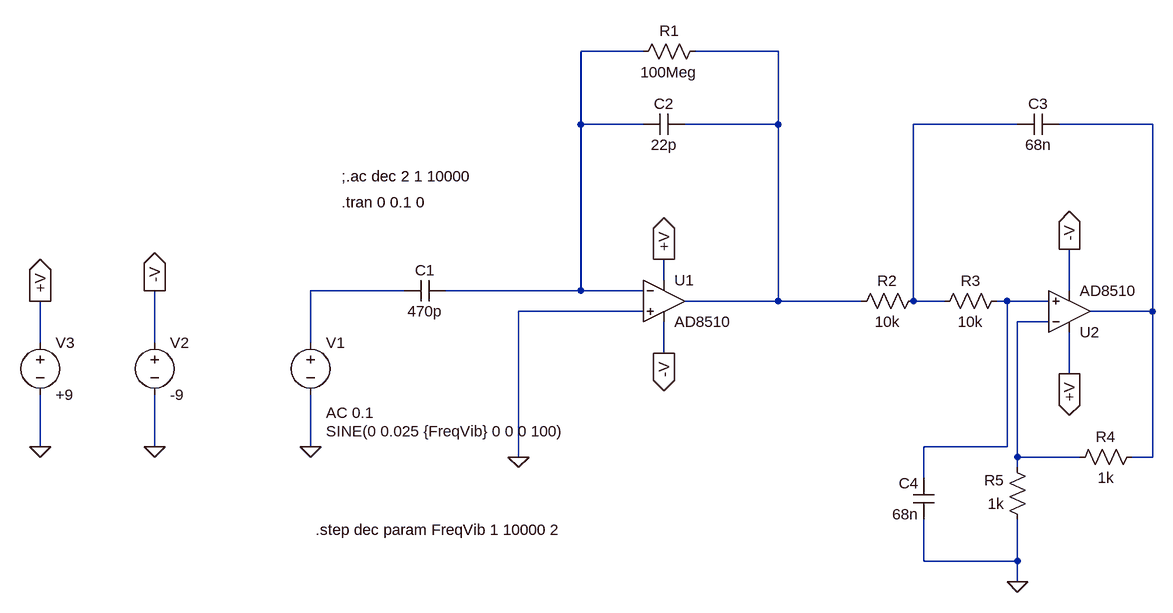
[diagram p0: schematic piezo-film-ac.asc]
piezo-film-ac.asc, the LTspice schematic file:
Version 4
SHEET 1 1420 680
WIRE 224 -240 128 -240
WIRE 432 -240 304 -240
WIRE 128 -128 128 -240
WIRE 224 -128 128 -128
WIRE 432 -128 432 -240
WIRE 432 -128 288 -128
WIRE 800 -128 640 -128
WIRE 1008 -128 864 -128
WIRE 256 112 256 80
WIRE -144 128 -288 128
WIRE 128 128 128 -128
WIRE 128 128 -80 128
WIRE 224 128 128 128
WIRE 880 128 880 64
WIRE 432 144 432 -128
WIRE 432 144 288 144
WIRE 560 144 432 144
WIRE 640 144 640 -128
WIRE 688 144 640 144
WIRE 784 144 768 144
WIRE 848 144 784 144
WIRE 224 160 32 160
WIRE 1008 160 1008 -128
WIRE 1008 160 912 160
WIRE 848 176 800 176
WIRE -704 208 -704 144
WIRE -528 208 -528 128
WIRE -288 208 -288 128
WIRE 256 224 256 176
WIRE 880 256 880 192
WIRE -704 368 -704 288
WIRE -528 368 -528 288
WIRE -288 368 -288 288
WIRE 784 368 784 144
WIRE 784 368 656 368
WIRE 32 384 32 160
WIRE 800 384 800 176
WIRE 896 384 800 384
WIRE 1008 384 1008 160
WIRE 1008 384 976 384
WIRE 800 400 800 384
WIRE 656 416 656 368
WIRE 656 544 656 480
WIRE 800 544 800 480
WIRE 800 544 656 544
WIRE 800 576 800 544
FLAG 32 384 0
FLAG -528 368 0
FLAG -704 368 0
FLAG -704 144 +V
IOPIN -704 144 Out
FLAG -528 128 -V
IOPIN -528 128 Out
FLAG -288 368 0
FLAG 256 224 -V
IOPIN 256 224 Out
FLAG 256 80 +V
IOPIN 256 80 Out
FLAG 880 256 +V
IOPIN 880 256 Out
FLAG 880 64 -V
IOPIN 880 64 Out
FLAG 800 576 0
SYMBOL Opamps\\AD8510 256 80 R0
SYMATTR InstName U1
SYMBOL voltage -288 192 R0
WINDOW 3 24 152 Left 2
WINDOW 123 24 124 Left 2
WINDOW 39 0 0 Left 2
SYMATTR Value SINE(0 0.025 {FreqVib} 0 0 0 100)
SYMATTR Value2 AC 0.1
SYMATTR InstName V1
SYMBOL cap -80 112 R90
WINDOW 0 0 32 VBottom 2
WINDOW 3 32 32 VTop 2
SYMATTR InstName C1
SYMATTR Value 470p
SYMBOL cap 288 -144 R90
WINDOW 0 0 32 VBottom 2
WINDOW 3 32 32 VTop 2
SYMATTR InstName C2
SYMATTR Value 22p
SYMBOL res 320 -256 R90
WINDOW 0 0 56 VBottom 2
WINDOW 3 32 56 VTop 2
SYMATTR InstName R1
SYMATTR Value 100Meg
SYMBOL voltage -528 192 R0
WINDOW 123 0 0 Left 2
WINDOW 39 0 0 Left 2
SYMATTR InstName V2
SYMATTR Value -9
SYMBOL voltage -704 192 R0
WINDOW 123 0 0 Left 2
WINDOW 39 0 0 Left 2
SYMATTR InstName V3
SYMATTR Value +9
SYMBOL Opamps\\AD8510 880 224 M180
SYMATTR InstName U2
SYMBOL res 656 128 R90
WINDOW 0 0 56 VBottom 2
WINDOW 3 32 56 VTop 2
SYMATTR InstName R2
SYMATTR Value 10k
SYMBOL res 784 128 R90
WINDOW 0 0 56 VBottom 2
WINDOW 3 32 56 VTop 2
SYMATTR InstName R3
SYMATTR Value 10k
SYMBOL res 992 368 R90
WINDOW 0 0 56 VBottom 2
WINDOW 3 32 56 VTop 2
SYMATTR InstName R4
SYMATTR Value 1k
SYMBOL res 816 496 R180
WINDOW 0 36 76 Left 2
WINDOW 3 36 40 Left 2
SYMATTR InstName R5
SYMATTR Value 1k
SYMBOL cap 864 -144 R90
WINDOW 0 0 32 VBottom 2
WINDOW 3 32 32 VTop 2
SYMATTR InstName C3
SYMATTR Value 68n
SYMBOL cap 672 480 R180
WINDOW 0 24 56 Left 2
WINDOW 3 24 8 Left 2
SYMATTR InstName C4
SYMATTR Value 68n
TEXT -240 -48 Left 2 !;.ac dec 2 1 10000
TEXT -280 496 Left 2 !.step dec param FreqVib 1 10000 2
TEXT -240 -8 Left 2 !.tran 0 0.1 0

The netlist it stands for:
* piezo-film-ac.asc
XU1 0 N001 +V -V N002 AD8510  ; pins In+ In- V+ V- OUT
V1 N005 0 SINE(0 0.025 {FreqVib} 0 0 0 100) AC 0.1
C1 N001 N005 470p
C2 N002 N001 22p
R1 N002 N001 100Meg
V2 -V 0 -9
V3 +V 0 +9
XU2 N006 N007 +V -V N004 AD8510  ; pins In+ In- V+ V- OUT
R2 N003 N002 10k
R3 N006 N003 10k
R4 N004 N007 1k
R5 0 N007 1k
C3 N004 N003 68n
C4 0 N006 68n
;.ac dec 2 1 10000
.step dec param FreqVib 1 10000 2
.tran 0 0.1 0
.backanno
.end